# EAGLE design frienship_1 (EAGLE 6.1)
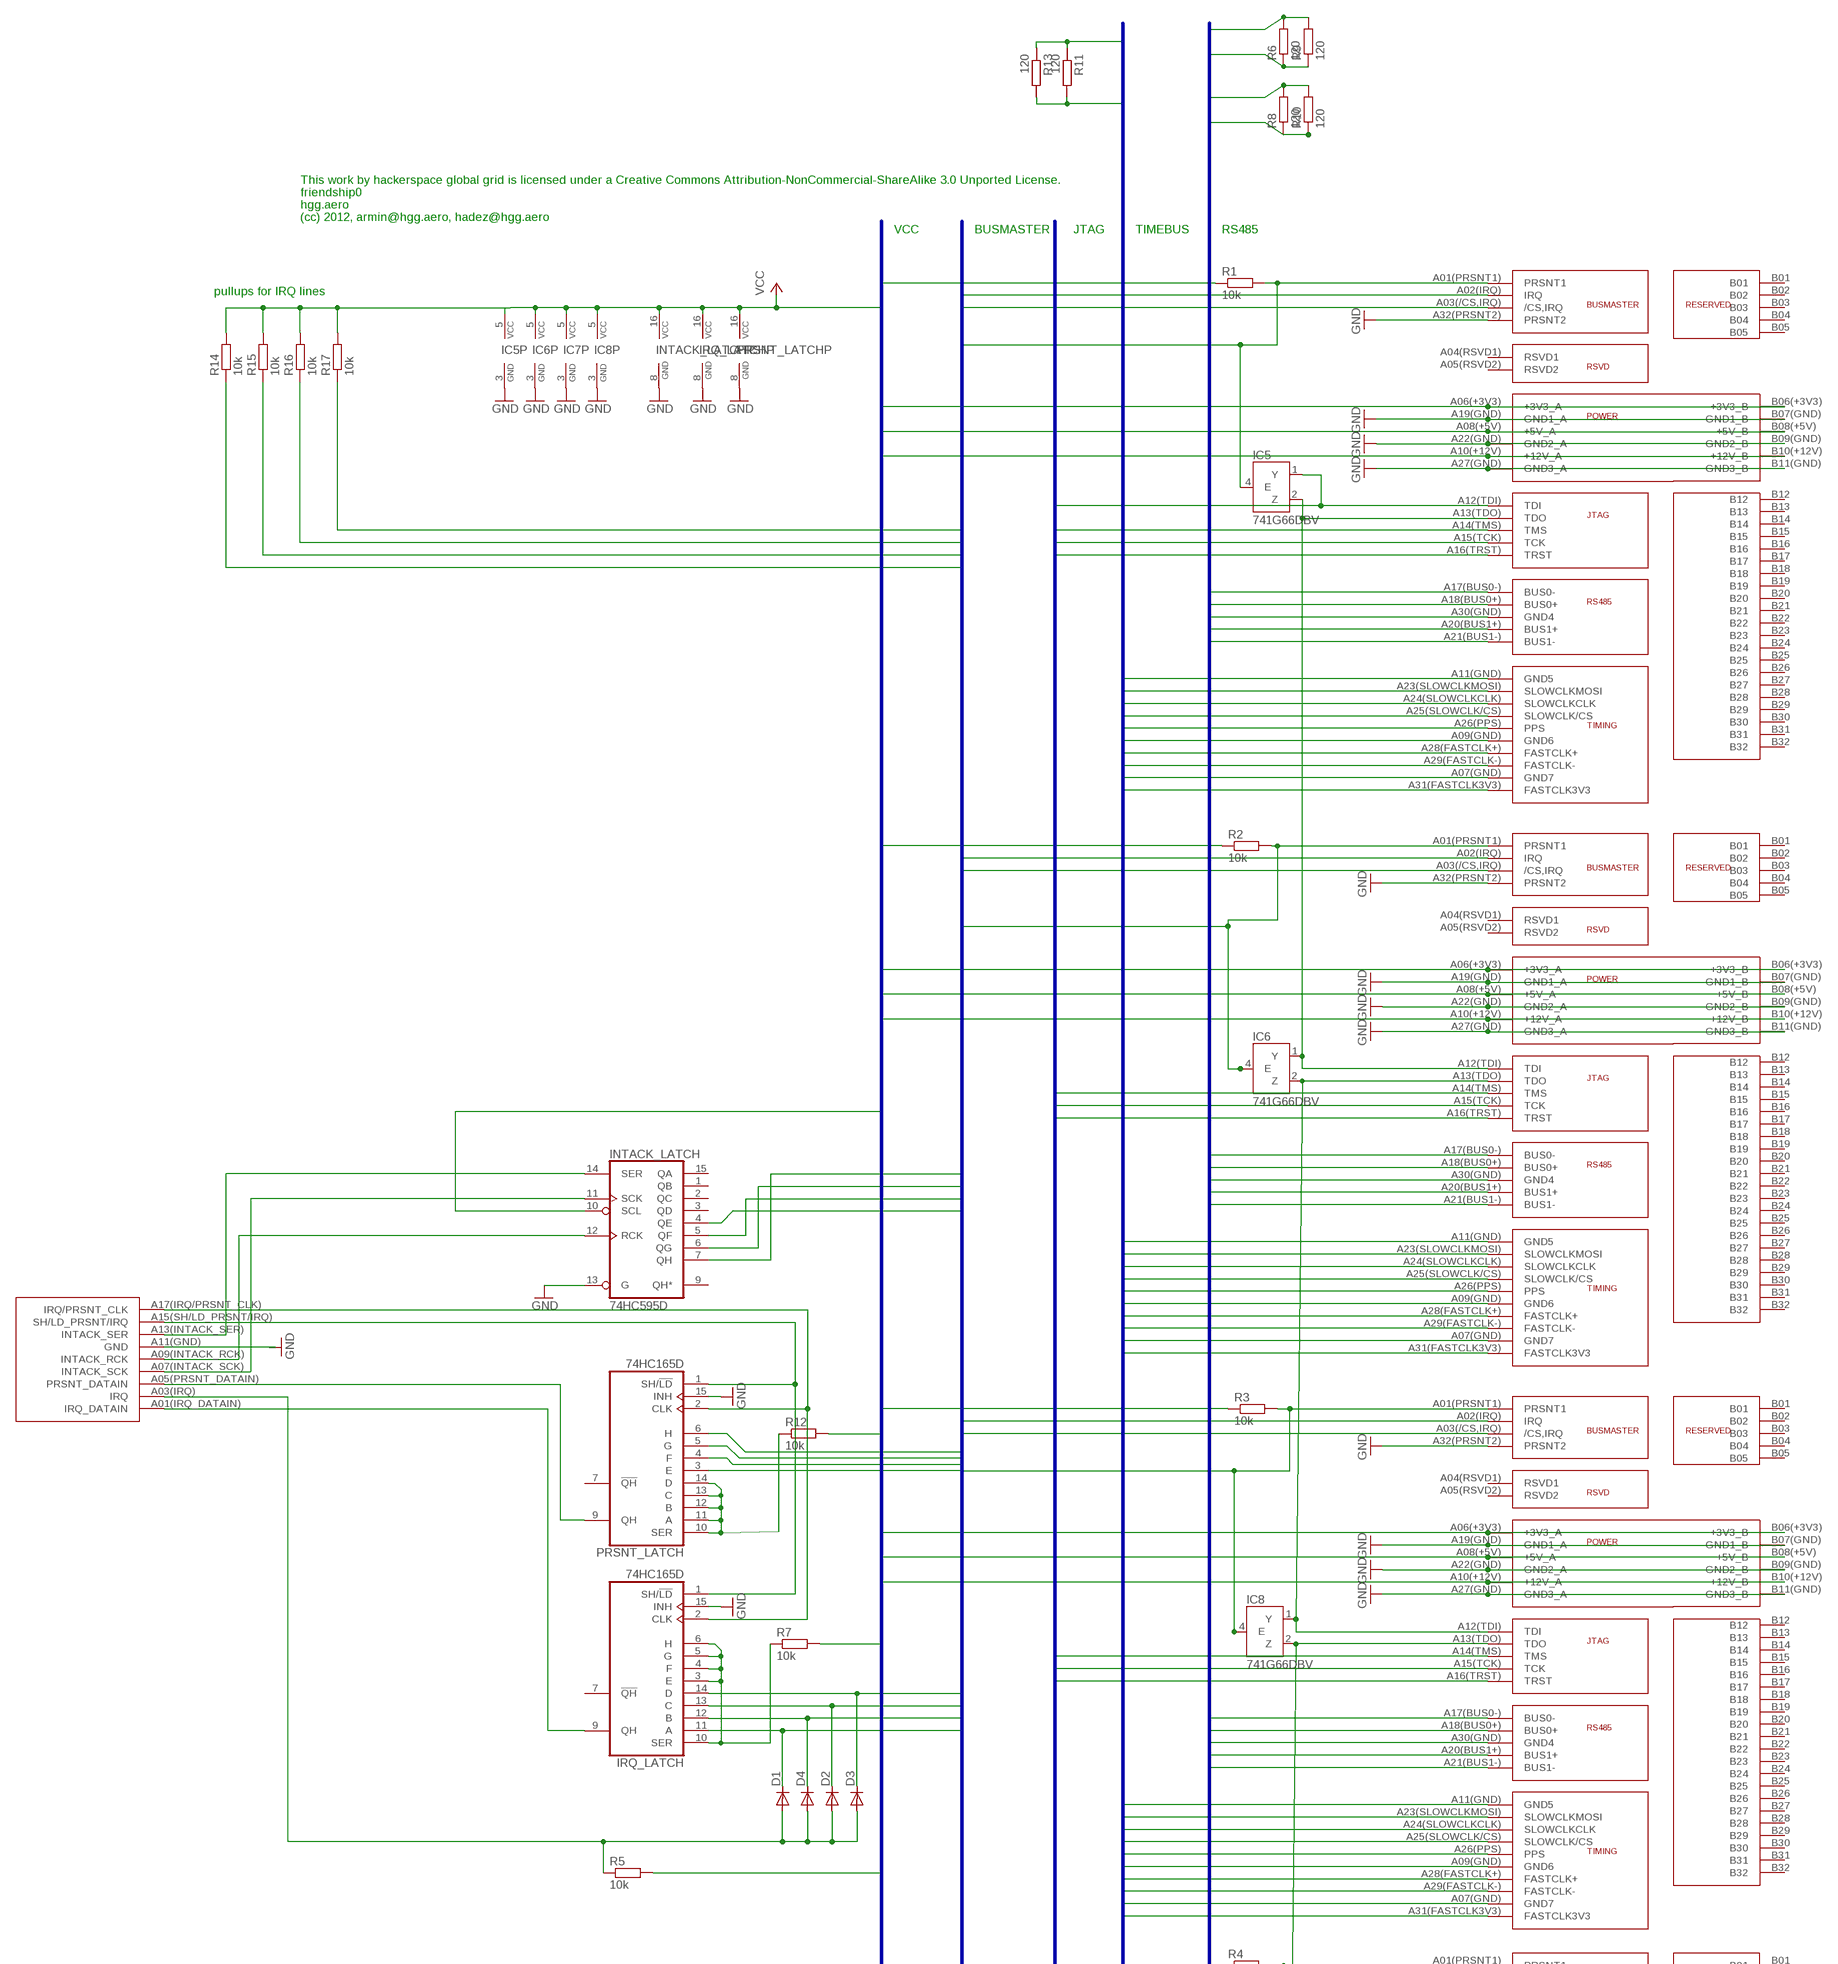
[diagram p0: schematic, sheet 1, part 1 of 2]
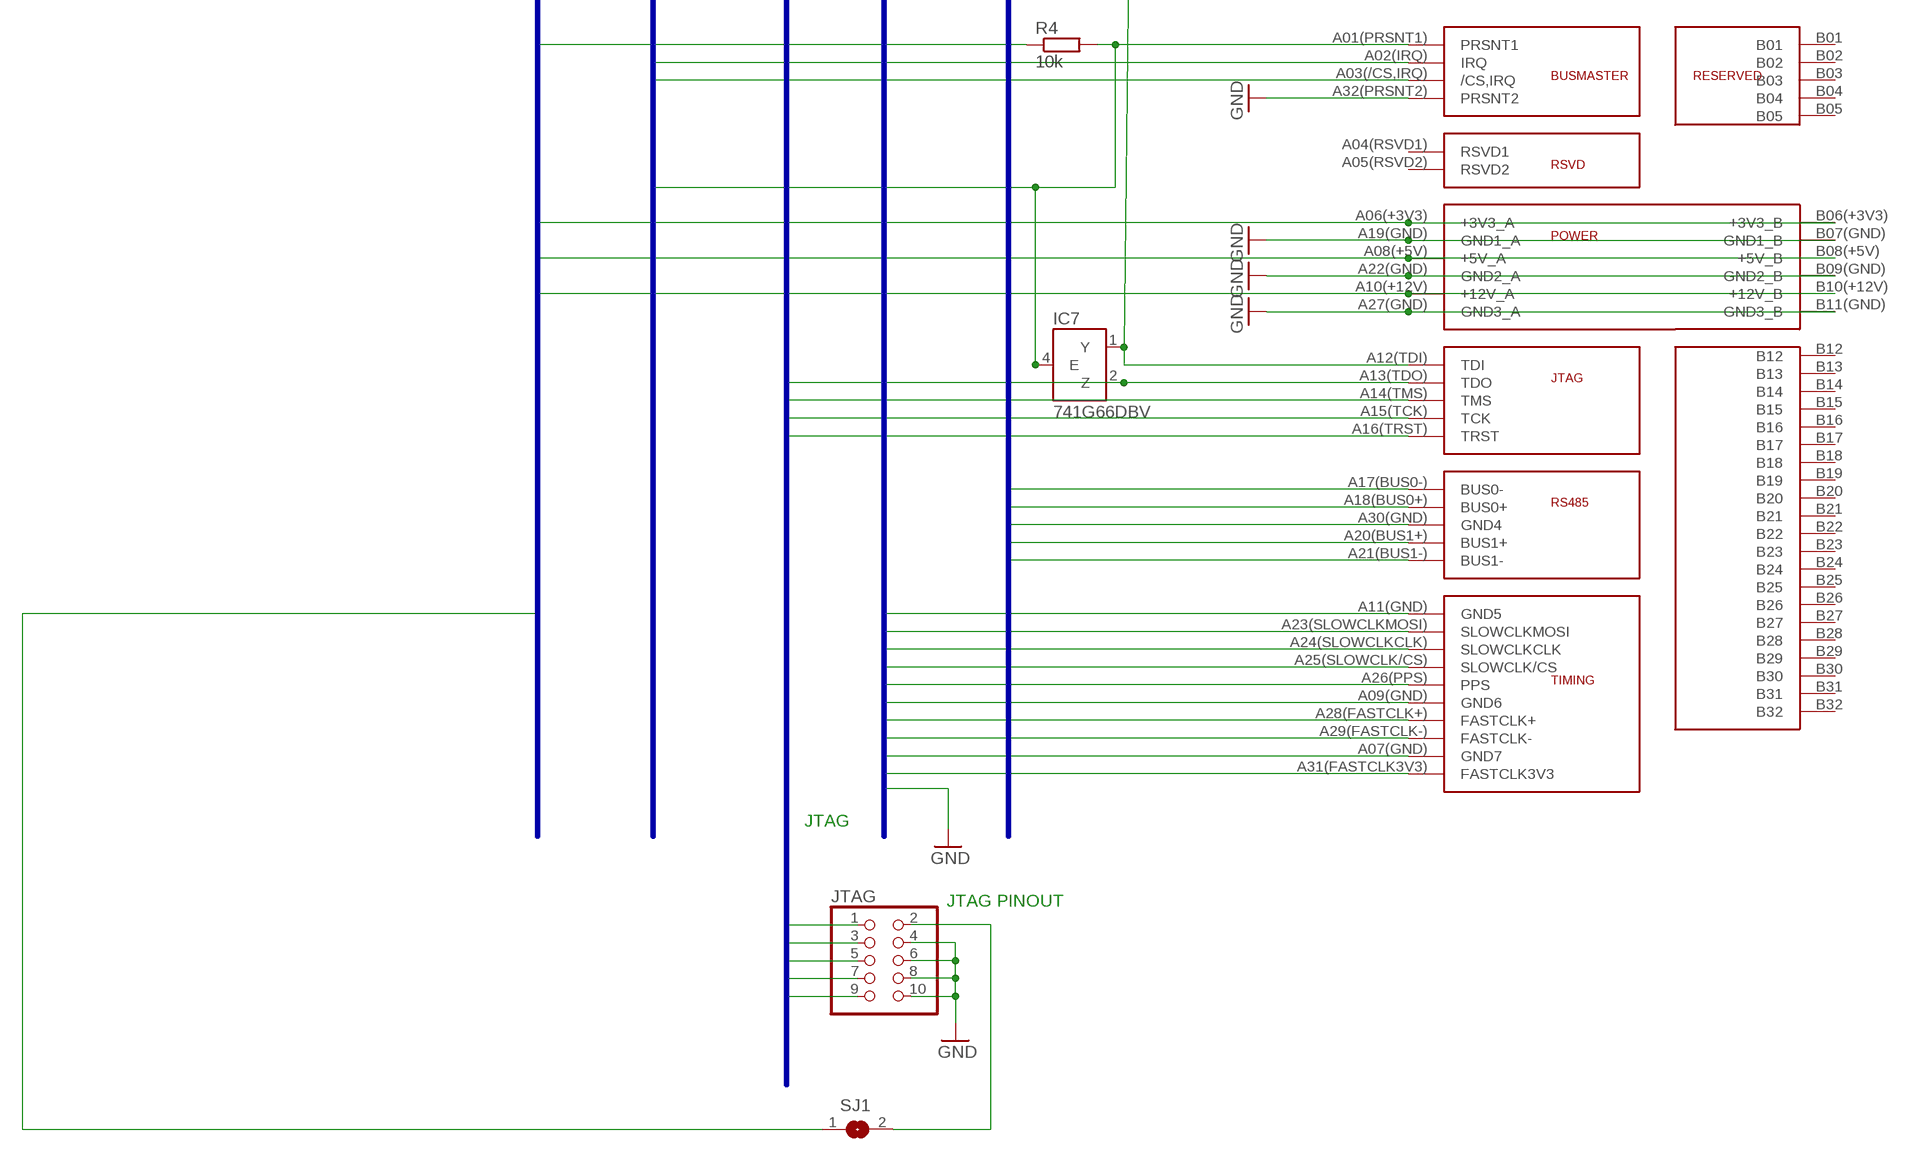
[diagram p1: schematic, sheet 1, part 2 of 2]

## Parts
D1  DIODE-SOD80C  [SOD80C]
D2  DIODE-SOD80C  [SOD80C]
D3  DIODE-SOD80C  [SOD80C]
D4  DIODE-SOD80C  [SOD80C]
IC5  741G66DBV  [SOT23-5]
IC6  741G66DBV  [SOT23-5]
IC7  741G66DBV  [SOT23-5]
IC8  741G66DBV  [SOT23-5]
INTACK_LATCH  74HC595D  [SO16]
IRQ_LATCH  74HC165D  [SO16]
JTAG  PINHD-2X5  [2X05]
PORT0  FRIENDSHIPSLOT  [FRIENDSHIP_SLOT]
PORT1  FRIENDSHIPSLOT  [FRIENDSHIP_SLOT]
PORT2  FRIENDSHIPSLOT  [FRIENDSHIP_SLOT]
PORT3  FRIENDSHIPSLOT  [FRIENDSHIP_SLOT]
PRSNT_LATCH  74HC165D  [SO16]
R1  10k  R-EU_R0603  [R0603]
R2  10k  R-EU_R0603  [R0603]
R3  10k  R-EU_R0603  [R0603]
R4  10k  R-EU_R0603  [R0603]
R5  10k  R-EU_R0603  [R0603]
R6  120  R-EU_R0603  [R0603]
R7  10k  R-EU_R0603  [R0603]
R8  120  R-EU_R0603  [R0603]
R9  120  R-EU_R0603  [R0603]
R10  120  R-EU_R0603  [R0603]
R11  120  R-EU_R0603  [R0603]
R12  10k  R-EU_R0603  [R0603]
R13  120  R-EU_R0603  [R0603]
R14  10k  R-EU_R0603  [R0603]
R15  10k  R-EU_R0603  [R0603]
R16  10k  R-EU_R0603  [R0603]
R17  10k  R-EU_R0603  [R0603]
SJ1  SJ  [SJ]
U$1  BUSMASTER_PLUG  [BUSMASTER_SLOT]

## Nets
3V3: IC5.5(VCC) IC6.5(VCC) IC7.5(VCC) IC8.5(VCC) INTACK_LATCH.10(SCL) INTACK_LATCH.16(VCC) IRQ_LATCH.16(VCC) PORT0.A06(+3V3)(+3V3_A) PORT0.B06(+3V3)(+3V3_B) PORT1.A06(+3V3)(+3V3_A) PORT1.B06(+3V3)(+3V3_B) PORT2.A06(+3V3)(+3V3_A) PORT2.B06(+3V3)(+3V3_B) PORT3.A06(+3V3)(+3V3_A) PORT3.B06(+3V3)(+3V3_B) PRSNT_LATCH.16(VCC) R1.1 R2.1 R3.1 R4.1 R5.2 R7.2 R12.2 R14.2 R15.2 R16.2 R17.2 SJ1.1 ; supply symbol labelled VCC
5V: PORT0.A08(+5V)(+5V_A) PORT0.B08(+5V)(+5V_B) PORT1.A08(+5V)(+5V_A) PORT1.B08(+5V)(+5V_B) PORT2.A08(+5V)(+5V_A) PORT2.B08(+5V)(+5V_B) PORT3.A08(+5V)(+5V_A) PORT3.B08(+5V)(+5V_B)
12V: PORT0.A10(+12V)(+12V_A) PORT0.B10(+12V)(+12V_B) PORT1.A10(+12V)(+12V_A) PORT1.B10(+12V)(+12V_B) PORT2.A10(+12V)(+12V_A) PORT2.B10(+12V)(+12V_B) PORT3.A10(+12V)(+12V_A) PORT3.B10(+12V)(+12V_B)
/CS: PORT0.A25(SLOWCLK/CS)(SLOWCLK/CS) PORT1.A25(SLOWCLK/CS)(SLOWCLK/CS) PORT2.A25(SLOWCLK/CS)(SLOWCLK/CS) PORT3.A25(SLOWCLK/CS)(SLOWCLK/CS)
/CS0: INTACK_LATCH.7(QH) PORT0.A03(/CS,IRQ)(/CS,IRQ)
/CS1: INTACK_LATCH.6(QG) PORT1.A03(/CS,IRQ)(/CS,IRQ)
/CS2: INTACK_LATCH.5(QF) PORT2.A03(/CS,IRQ)(/CS,IRQ)
/CS3: INTACK_LATCH.4(QE) PORT3.A03(/CS,IRQ)(/CS,IRQ)
CLK: PORT0.A24(SLOWCLKCLK)(SLOWCLKCLK) PORT1.A24(SLOWCLKCLK)(SLOWCLKCLK) PORT2.A24(SLOWCLKCLK)(SLOWCLKCLK) PORT3.A24(SLOWCLKCLK)(SLOWCLKCLK)
FASTCLK3V3: PORT0.A31(FASTCLK3V3)(FASTCLK3V3) PORT1.A31(FASTCLK3V3)(FASTCLK3V3) PORT2.A31(FASTCLK3V3)(FASTCLK3V3) PORT3.A31(FASTCLK3V3)(FASTCLK3V3)
FASTCLK+: PORT0.A28(FASTCLK+)(FASTCLK+) PORT1.A28(FASTCLK+)(FASTCLK+) PORT2.A28(FASTCLK+)(FASTCLK+) PORT3.A28(FASTCLK+)(FASTCLK+) R11.1 R13.1
FASTCLK-: PORT0.A29(FASTCLK-)(FASTCLK-) PORT1.A29(FASTCLK-)(FASTCLK-) PORT2.A29(FASTCLK-)(FASTCLK-) PORT3.A29(FASTCLK-)(FASTCLK-) R11.2 R13.2
GND: IC5.3(GND) IC6.3(GND) IC7.3(GND) IC8.3(GND) INTACK_LATCH.8(GND) INTACK_LATCH.13(G) IRQ_LATCH.8(GND) IRQ_LATCH.15(INH) JTAG.4 JTAG.6 JTAG.8 JTAG.10 PORT0.A07(GND)(GND7) PORT0.A09(GND)(GND6) PORT0.A11(GND)(GND5) PORT0.A19(GND)(GND1_A) PORT0.A22(GND)(GND2_A) PORT0.A27(GND)(GND3_A) PORT0.A30(GND)(GND4) PORT0.A32(PRSNT2)(PRSNT2) PORT0.B07(GND)(GND1_B) PORT0.B09(GND)(GND2_B) PORT0.B11(GND)(GND3_B) PORT1.A07(GND)(GND7) PORT1.A09(GND)(GND6) PORT1.A11(GND)(GND5) PORT1.A19(GND)(GND1_A) PORT1.A22(GND)(GND2_A) PORT1.A27(GND)(GND3_A) PORT1.A30(GND)(GND4) PORT1.A32(PRSNT2)(PRSNT2) PORT1.B07(GND)(GND1_B) PORT1.B09(GND)(GND2_B) PORT1.B11(GND)(GND3_B) PORT2.A07(GND)(GND7) PORT2.A09(GND)(GND6) PORT2.A11(GND)(GND5) PORT2.A19(GND)(GND1_A) PORT2.A22(GND)(GND2_A) PORT2.A27(GND)(GND3_A) PORT2.A30(GND)(GND4) PORT2.A32(PRSNT2)(PRSNT2) PORT2.B07(GND)(GND1_B) PORT2.B09(GND)(GND2_B) PORT2.B11(GND)(GND3_B) PORT3.A07(GND)(GND7) PORT3.A09(GND)(GND6) PORT3.A11(GND)(GND5) PORT3.A19(GND)(GND1_A) PORT3.A22(GND)(GND2_A) PORT3.A27(GND)(GND3_A) PORT3.A30(GND)(GND4) PORT3.A32(PRSNT2)(PRSNT2) PORT3.B07(GND)(GND1_B) PORT3.B09(GND)(GND2_B) PORT3.B11(GND)(GND3_B) PRSNT_LATCH.8(GND) PRSNT_LATCH.15(INH)
IRQ0: D3.C IRQ_LATCH.14(D) PORT0.A02(IRQ)(IRQ) R17.1
IRQ1: D2.C IRQ_LATCH.13(C) PORT1.A02(IRQ)(IRQ) R16.1
IRQ2: D4.C IRQ_LATCH.12(B) PORT2.A02(IRQ)(IRQ) R15.1
IRQ3: D1.C IRQ_LATCH.11(A) PORT3.A02(IRQ)(IRQ) R14.1
MOSI: PORT0.A23(SLOWCLKMOSI)(SLOWCLKMOSI) PORT1.A23(SLOWCLKMOSI)(SLOWCLKMOSI) PORT2.A23(SLOWCLKMOSI)(SLOWCLKMOSI) PORT3.A23(SLOWCLKMOSI)(SLOWCLKMOSI)
N$1: INTACK_LATCH.14(SER) U$1.A13(INTACK_SER)(INTACK_SER)
N$2: IC5.2(Z) IC6.1(Y) PORT0.A13(TDO)(TDO) PORT1.A12(TDI)(TDI)
N$3: IRQ_LATCH.1(SH/!LD) PRSNT_LATCH.1(SH/!LD) U$1.A15(SH/LD_PRSNT/IRQ)(SH/LD_PRSNT/IRQ)
N$4: INTACK_LATCH.11(SCK) U$1.A07(INTACK_SCK)(INTACK_SCK)
N$5: JTAG.2 SJ1.2
N$6: IC6.2(Z) IC8.1(Y) PORT1.A13(TDO)(TDO) PORT2.A12(TDI)(TDI)
N$7: IC7.1(Y) IC8.2(Z) PORT2.A13(TDO)(TDO) PORT3.A12(TDI)(TDI)
N$8: IRQ_LATCH.3(E) IRQ_LATCH.4(F) IRQ_LATCH.5(G) IRQ_LATCH.6(H) IRQ_LATCH.10(SER) R7.1
N$9: INTACK_LATCH.12(RCK) U$1.A09(INTACK_RCK)(INTACK_RCK)
N$10: PRSNT_LATCH.10(SER) PRSNT_LATCH.11(A) PRSNT_LATCH.12(B) PRSNT_LATCH.13(C) PRSNT_LATCH.14(D) R12.1
N$11: D1.A D2.A D3.A D4.A R5.1 U$1.A03(IRQ)(IRQ)
N$12: U$1.A11(GND)(GND)
N$13: PRSNT_LATCH.9(QH) U$1.A05(PRSNT_DATAIN)(PRSNT_DATAIN)
N$17: IRQ_LATCH.9(QH) U$1.A01(IRQ_DATAIN)(IRQ_DATAIN)
PPS: PORT0.A26(PPS)(PPS) PORT1.A26(PPS)(PPS) PORT2.A26(PPS)(PPS) PORT3.A26(PPS)(PPS)
PRSNT0: IC5.4(E) PORT0.A01(PRSNT1)(PRSNT1) PRSNT_LATCH.6(H) R1.2
PRSNT1: IC6.4(E) PORT1.A01(PRSNT1)(PRSNT1) PRSNT_LATCH.5(G) R2.2
PRSNT2: IC8.4(E) PORT2.A01(PRSNT1)(PRSNT1) PRSNT_LATCH.4(F) R3.2
PRSNT3: IC7.4(E) PORT3.A01(PRSNT1)(PRSNT1) PRSNT_LATCH.3(E) R4.2
RX+: PORT0.A20(BUS1+)(BUS1+) PORT1.A20(BUS1+)(BUS1+) PORT2.A20(BUS1+)(BUS1+) PORT3.A20(BUS1+)(BUS1+) R8.2 R10.2
RX-: PORT0.A21(BUS1-)(BUS1-) PORT1.A21(BUS1-)(BUS1-) PORT2.A21(BUS1-)(BUS1-) PORT3.A21(BUS1-)(BUS1-) R8.1 R10.1
SHIFT: IRQ_LATCH.2(CLK) PRSNT_LATCH.2(CLK) U$1.A17(IRQ/PRSNT_CLK)(IRQ/PRSNT_CLK)
TCK: JTAG.7 PORT0.A15(TCK)(TCK) PORT1.A15(TCK)(TCK) PORT2.A15(TCK)(TCK) PORT3.A15(TCK)(TCK)
TDI: IC5.1(Y) JTAG.1 PORT0.A12(TDI)(TDI)
TDO: IC7.2(Z) JTAG.3 PORT3.A13(TDO)(TDO)
TMS: JTAG.5 PORT0.A14(TMS)(TMS) PORT1.A14(TMS)(TMS) PORT2.A14(TMS)(TMS) PORT3.A14(TMS)(TMS)
TRST: JTAG.9 PORT0.A16(TRST)(TRST) PORT1.A16(TRST)(TRST) PORT2.A16(TRST)(TRST) PORT3.A16(TRST)(TRST)
TX+: PORT0.A18(BUS0+)(BUS0+) PORT1.A18(BUS0+)(BUS0+) PORT2.A18(BUS0+)(BUS0+) PORT3.A18(BUS0+)(BUS0+) R6.2 R9.2
TX-: PORT0.A17(BUS0-)(BUS0-) PORT1.A17(BUS0-)(BUS0-) PORT2.A17(BUS0-)(BUS0-) PORT3.A17(BUS0-)(BUS0-) R6.1 R9.1
Unconnected: INTACK_LATCH.1(QB) INTACK_LATCH.2(QC) INTACK_LATCH.3(QD) INTACK_LATCH.9(QH*) INTACK_LATCH.15(QA) IRQ_LATCH.7(!QH) PORT0.A04(RSVD1)(RSVD1) PORT0.A05(RSVD2)(RSVD2) PORT0.B01 PORT0.B02 PORT0.B03 PORT0.B04 PORT0.B05 PORT0.B12 PORT0.B13 PORT0.B14 PORT0.B15 PORT0.B16 PORT0.B17 PORT0.B18 PORT0.B19 PORT0.B20 PORT0.B21 PORT0.B22 PORT0.B23 PORT0.B24 PORT0.B25 PORT0.B26 PORT0.B27 PORT0.B28 PORT0.B29 PORT0.B30 PORT0.B31 PORT0.B32 PORT1.A04(RSVD1)(RSVD1) PORT1.A05(RSVD2)(RSVD2) PORT1.B01 PORT1.B02 PORT1.B03 PORT1.B04 PORT1.B05 PORT1.B12 PORT1.B13 PORT1.B14 PORT1.B15 PORT1.B16 PORT1.B17 PORT1.B18 PORT1.B19 PORT1.B20 PORT1.B21 PORT1.B22 PORT1.B23 PORT1.B24 PORT1.B25 PORT1.B26 PORT1.B27 PORT1.B28 PORT1.B29 PORT1.B30 PORT1.B31 PORT1.B32 PORT2.A04(RSVD1)(RSVD1) PORT2.A05(RSVD2)(RSVD2) PORT2.B01 PORT2.B02 PORT2.B03 PORT2.B04 PORT2.B05 PORT2.B12 PORT2.B13 PORT2.B14 PORT2.B15 PORT2.B16 PORT2.B17 PORT2.B18 PORT2.B19 PORT2.B20 PORT2.B21 PORT2.B22 PORT2.B23 PORT2.B24 PORT2.B25 PORT2.B26 PORT2.B27 PORT2.B28 PORT2.B29 PORT2.B30 PORT2.B31 PORT2.B32 PORT3.A04(RSVD1)(RSVD1) PORT3.A05(RSVD2)(RSVD2) PORT3.B01 PORT3.B02 PORT3.B03 PORT3.B04 PORT3.B05 PORT3.B12 PORT3.B13 PORT3.B14 PORT3.B15 PORT3.B16 PORT3.B17 PORT3.B18 PORT3.B19 PORT3.B20 PORT3.B21 PORT3.B22 PORT3.B23 PORT3.B24 PORT3.B25 PORT3.B26 PORT3.B27 PORT3.B28 PORT3.B29 PORT3.B30 PORT3.B31 PORT3.B32 PRSNT_LATCH.7(!QH)

## Buses
IRQ0,IRQ1,IRQ2,IRQ3,/CS0,/CS1,/CS2,/CS3,PRSNT0,PRSNT1,PRSNT2,PRSNT3
TDI,TDO,TMS,TCK,TRST
GND,MOSI,CLK,/CS,PPS,FASTCLK+,FASTCLK-,FASTCLK3V3
TX+,TX-,GND,RX+,RX-
3V3,5V,12V

## Notes on the sheet
- This work by hackerspace global grid is licensed under a Creative Commons Attribution-NonCommercial-ShareAlike 3.0 Unported License.
- friendship0
- hgg.aero
- (cc) 2012, armin@hgg.aero, hadez@hgg.aero
- VCC | BUSMASTER | JTAG | TIMEBUS | RS485
- pullups for IRQ lines
- JTAG
- JTAG PINOUT

## Library data of the parts
D1-D4 = diode:DIODE-: DIODE
IC5-IC8 = 74xx-little-de:74*1G66: Single Analog / Bilateral Switch Source: http://www.semiconductors.philips.com/acrobat_download/datasheets/74HC_HCT1G66_3.pdf
INTACK_LATCH = 74xx-eu:74*595: 8-bit SHIFT REGISTER, output latch
IRQ_LATCH PRSNT_LATCH = 74xx-eu:74*165: 8-bit parallel load SHIFT REGISTER
JTAG = pinhead:PINHD-2X5: PIN HEADER
PORT0 PORT1-PORT3 = hgg:FRIENDSHIP
R1-R17 = rcl:R-EU_: RESISTOR, European symbol
SJ1 = jumper:SJ: SMD solder JUMPER
U$1 = hgg:BUSMASTER_PLUG

## Board
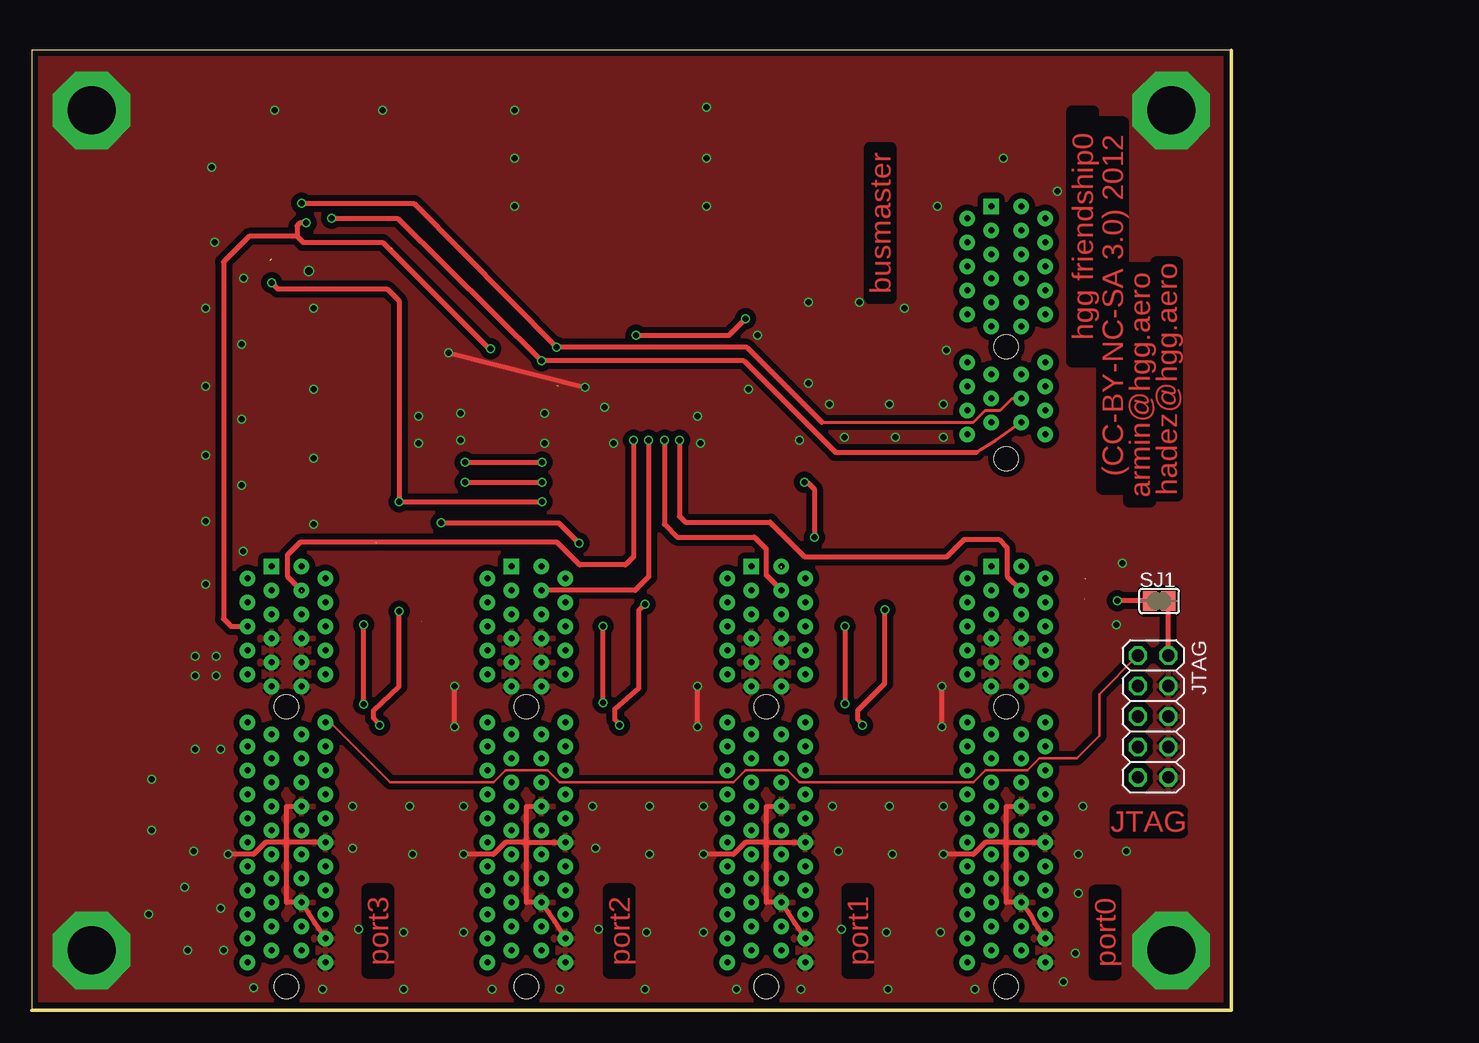
[diagram p2: board, top side]
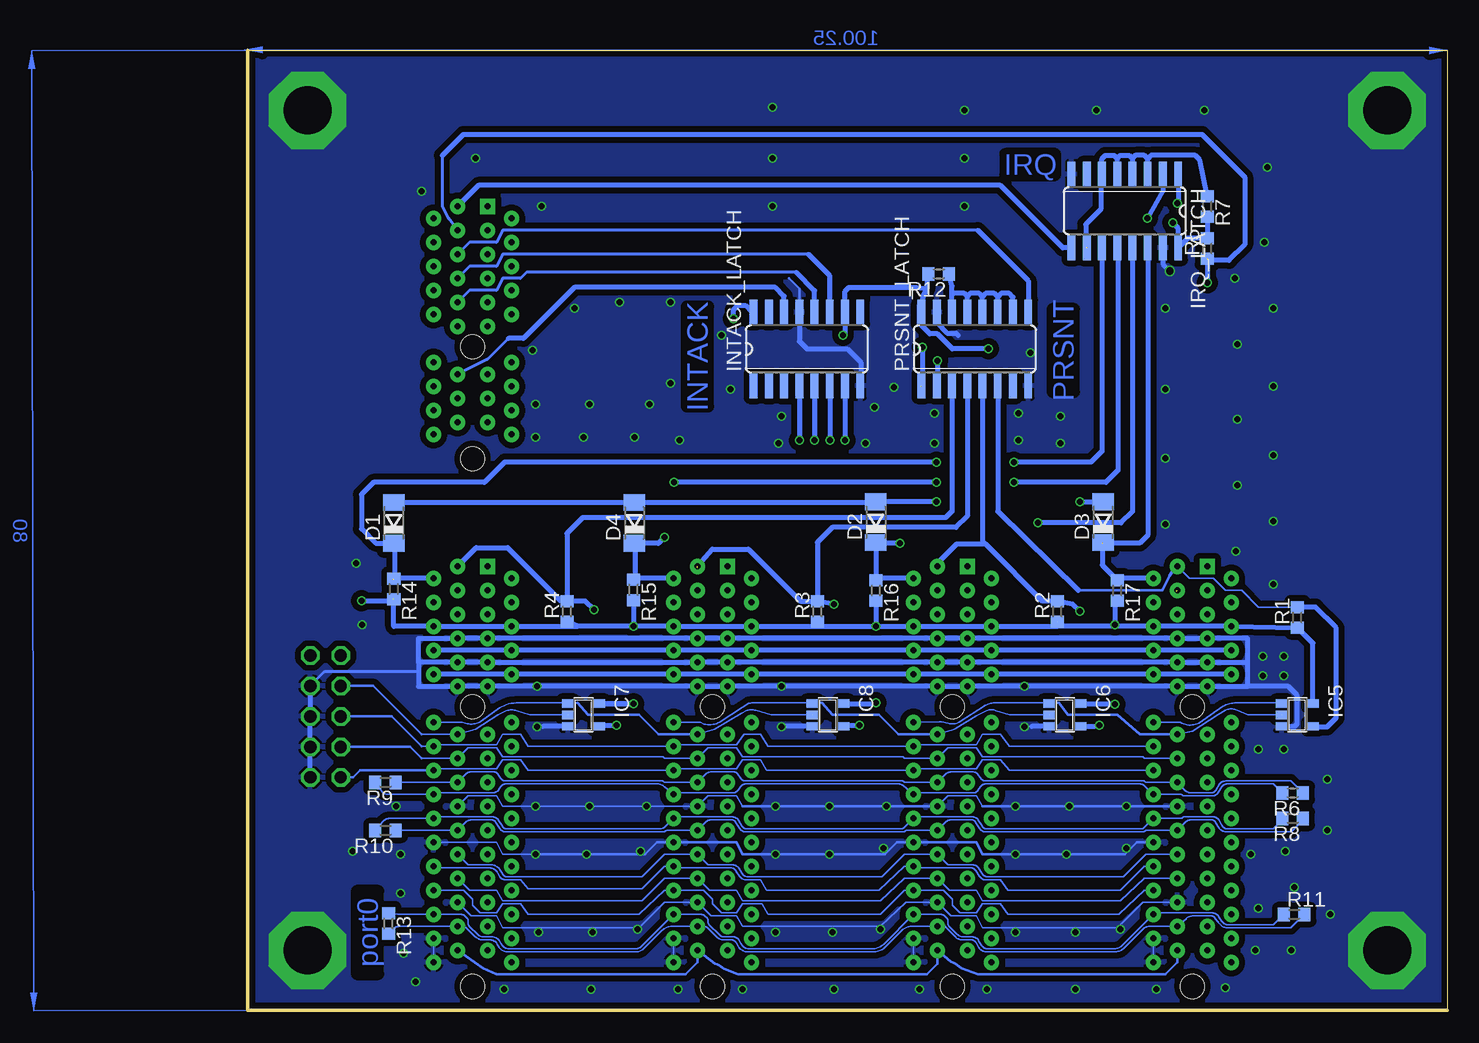
[diagram p3: board, bottom side, seen from below]

Size 100 x 80 mm. Coordinates in mm from the lower left corner, seen from the top.
Outline: 0,0 100,0 100,80 0,80 0,0
Copper layers (1*16): Top 0.035mm / dielectric 1.5mm / Bottom 0.035mm
Design rules: minimum track width 0.125mm, minimum drill 0.2mm, track to track 0.125mm, track to pad 0.125mm, pad to pad 0.125mm, via to via 0.125mm, smd to smd 0.125mm, copper to edge 0.3mm, drill to drill 0.2mm, minimum pad ring 0.2mm, minimum via ring 0.125mm, stop-mask expansion 0.075mm, vias tented up to drill 0mil, thermal gap 0.2mm

### Footprints (pad centres in the part's own frame; a part is rotated, then mirrored left to right if it is on the bottom)
SOD80C = smd 1.4 x 1.8: A 1.7,0; C -1.7,0
SOT23-5 = smd 0.69 x 0.99: 1 -0.95,-1.29; 2 0,-1.29; 3 0.95,-1.29; 4 0.95,1.3; 5 -0.95,1.3
SO16 = smd 0.66 x 2.032: 1 -4.445,-3.073; 2 -3.175,-3.073; 3 -1.905,-3.073; 4 -0.635,-3.073; 5 0.635,-3.073; 6 1.905,-3.073; 7 3.175,-3.073; 8 4.445,-3.073; 9 4.445,3.073; 10 3.175,3.073; 11 1.905,3.073; 12 0.635,3.073; 13 -0.635,3.073; 14 -1.905,3.073; 15 -3.175,3.073; 16 -4.445,3.073
2X05 = drill 1.016 octagon: 1 -5.08,-1.27; 2 -5.08,1.27; 3 -2.54,-1.27; 4 -2.54,1.27; 5 0,-1.27; 6 0,1.27; 7 2.54,-1.27; 8 2.54,1.27; 9 5.08,-1.27; 10 5.08,1.27
FRIENDSHIP_SLOT = drill 0.5 pad 1.27: A01(PRSNT1) 0,2.5; A02(IRQ) 1,4.5; A03(/CS,IRQ) 2,2.5; A04(RSVD1) 3,4.5; A05(RSVD2) 4,2.5; A06(+3V3) 5,4.5; A07(GND) 6,2.5; A08(+5V) 7,4.5; A09(GND) 8,2.5; A10(+12V) 9,4.5; A11(GND) 10,2.5; A12(TDI) 13,4.5; A13(TDO) 14,2.5; A14(TMS) 15,4.5; A15(TCK) 16,2.5; A16(TRST) 17,4.5; A17(BUS0-) 18,2.5; A18(BUS0+) 19,4.5; A19(GND) 20,2.5; A20(BUS1+) 21,4.5; A21(BUS1-) 22,2.5; A22(GND) 23,4.5; A23(SLOWCLKMOSI) 24,2.5; A24(SLOWCLKCLK) 25,4.5; A25(SLOWCLK/CS) 26,2.5; A26(PPS) 27,4.5; A27(GND) 28,2.5; A28(FASTCLK+) 29,4.5; A29(FASTCLK-) 30,2.5; A30(GND) 31,4.5; A31(FASTCLK3V3) 32,2.5; A32(PRSNT2) 33,4.5; B02 1,-2; B03 2,0; B04 3,-2; B05 4,0; B06(+3V3) 5,-2; B07(GND) 6,0; B08(+5V) 7,-2; B09(GND) 8,0; B10(+12V) 9,-2; B11(GND) 10,0; B12 13,-2; B13 14,0; B14 15,-2; B15 16,0; B16 17,-2; B17 18,0; B18 19,-2; B19 20,0; B20 21,-2; B21 22,0; B22 23,-2; B23 24,0; B24 25,-2; B25 26,0; B26 27,-2; B27 28,0; B28 29,-2; B29 30,0; B30 31,-2; B31 32,0; B32 33,-2 | drill 0.5 pad 1.27 square: B01 0,0 | hole 2: 11.7,1.25; 35,1.25
R0603 = smd 1 x 1.1: 1 -0.85,0; 2 0.85,0
SJ = smd 1.168 x 1.6: 1 -0.762,0; 2 0.762,0
BUSMASTER_SLOT = drill 0.5 pad 1.27: A01(IRQ_DATAIN) 0,2.5; A02 1,4.5; A03(IRQ) 2,2.5; A04 3,4.5; A05(PRSNT_DATAIN) 4,2.5; A06 5,4.5; A07(INTACK_SCK) 6,2.5; A08 7,4.5; A09(INTACK_RCK) 8,2.5; A10 9,4.5; A11(GND) 10,2.5; A12 13,4.5; A13(INTACK_SER) 14,2.5; A14 15,4.5; A15(SH/LD_PRSNT/IRQ) 16,2.5; A16 17,4.5; A17(IRQ/PRSNT_CLK) 18,2.5; A18 19,4.5; B02 1,-2; B03 2,0; B04 3,-2; B05 4,0; B06 5,-2; B07 6,0; B08 7,-2; B09 8,0; B10 9,-2; B11 10,0; B12 13,-2; B13 14,0; B14 15,-2; B15 16,0; B16 17,-2; B17 18,0; B18 19,-2 | drill 0.5 pad 1.27 square: B01 0,0 | hole 2: 11.7,1.25; 21.03,1.25

### Placement (x,y rotation side)
D1  87.81,40.62 90 bottom
D2  47.62,40.69 90 bottom
D3  28.69,40.69 90 bottom
D4  67.75,40.62 90 bottom
IC5  12.5,24.62 270 bottom
IC6  31.88,24.62 270 bottom
IC7  72,24.62 270 bottom
IC8  51.62,24.62 270 bottom
INTACK_LATCH  53.38,55.12 0 bottom
IRQ_LATCH  26.88,66.62 180 bottom
JTAG  93.5,24.5 270 top
PORT0  20,37 270 top
PORT1  40,37 270 top
PORT2  60,37 270 top
PORT3  80,37 270 top
PRSNT_LATCH  39.38,55.12 0 bottom
R1  12.5,32.75 90 bottom
R2  32.5,33.25 90 bottom
R3  52.5,33.25 90 bottom
R4  73.38,33.25 90 bottom
R5  20,63.5 90 bottom
R6  12.88,18.12 180 bottom
R7  20,67 270 bottom
R8  12.88,16 180 bottom
R9  88.5,19 180 bottom
R10  88.5,15 180 bottom
R11  12.75,8 0 bottom
R12  42.38,61.38 180 bottom
R13  88.25,7.25 270 bottom
R14  87.81,35.12 270 bottom
R15  67.84,35.05 270 bottom
R16  47.62,35 270 bottom
R17  27.5,35 270 bottom
SJ1  94,34.12 0 top
U$1  80,67 270 top

### Tracks (layer width: path | path; a pad name or v marks a point on that pad's centre or on a via)
3V3  (via drill 0.5)  (2 unrouted)
  Top 0.406: v47.62,25.62 v47.62,32 | v22.88,65.62 22.38,65.62 22.12,65.38 22.12,64.5 | 22.12,64.5 22.62,64 29.25,64 38.12,55.12 v38.25,55.12 | v50.38,56.25 58.12,56.25 v59.5,57.62 | 22.12,64.5 18.12,64.5 16,62.38 16,32.62 16.62,32 PORT0.B06(+3V3) | v27.69,25.5 v27.69,32.12 | v67.81,32 v67.81,25.56 | SJ1.1 v90.5,34.12
  Bottom 0.125: R12.2 43.38,61.23
  Bottom 0.406: R7.2 R5.2 21.63,64.35 IRQ_LATCH.16 22.43,65.18 v22.88,65.62 | 52.5,32 v47.62,32 | v47.62,32 PORT1.A06(+3V3) PORT1.B06(+3V3) 32.5,32 R2.1 | 52.5,32 PORT2.B06(+3V3) PORT2.A06(+3V3) v67.81,32 | 52.5,32 R3.1 | 73.5,32 PORT3.B06(+3V3) PORT3.A06(+3V3) 87.81,32 R14.2 | 72.5,32 R4.1 | IC8.5 47.67,25.57 v47.62,25.62 | IC5.5 11.2,30.6 R1.1 PORT0.B06(+3V3) PORT0.A06(+3V3) 27.69,32 | PRSNT_LATCH.16 43.74,59.03 | 43.74,59.03 43.7,59.43 43.38,60.12 | 43.38,61.23 43.38,60.12 | v38.25,55.12 41.25,55.12 42.5,56.38 43.12,56.38 44,57.25 44,58.77 43.74,59.03 | 43.38,60.12 44.25,60.25 49.88,60.25 50.2,59.92 INTACK_LATCH.10 50.2,56.42 v50.38,56.25 | v59.5,57.62 59.5,58.38 59.12,58.75 58.5,58.75 57.95,58.2 | 57.95,58.2 57.88,58.12 57.75,58.12 | INTACK_LATCH.16 57.95,58.2 | R16.2 v47.62,32 | 27.69,32 32.56,32 32.56,32.38 32.5,32.38 32.5,32.44 | R17.2 27.69,34.34 v27.69,32.12 27.69,32 | IC6.5 27.69,25.57 v27.69,25.5 | v67.81,32 72.5,32 | 73.5,32.25 73.5,32.44 73.31,32.44 73.31,32.38 73.38,32.38 73.38,32.25 73.5,32.25 | 73.5,32.25 73.5,32 | 73.5,32 72.5,32 | R15.2 67.81,34.2 v67.81,32 | v90.5,34.12 87.81,34.12 87.81,34.31 | IC7.5 67.81,25.57 v67.81,25.56 IC7.5
5V
  Bottom 0.406: PORT0.B08(+5V) PORT0.A08(+5V) PORT1.B08(+5V) PORT1.A08(+5V) PORT2.B08(+5V) PORT2.A08(+5V) PORT3.B08(+5V) PORT3.A08(+5V)
12V
  Bottom 0.406: PORT0.B10(+12V) PORT0.A10(+12V) PORT1.B10(+12V) PORT1.A10(+12V) PORT2.B10(+12V) PORT2.A10(+12V) PORT3.B10(+12V) PORT3.A10(+12V)
/CS
  Bottom 0.125: PORT3.A25(SLOWCLK/CS) 81.5,10 79.25,10 78.75,9.12 67.12,9.12 65.25,11 PORT2.A25(SLOWCLK/CS) 61.5,10 59.25,10 58.75,9.12 47.25,9.12 45.25,11 PORT1.A25(SLOWCLK/CS) 41.5,10 39.25,10 38.75,9.12 27.25,9.12 25.25,11 PORT0.A25(SLOWCLK/CS)
/CS0  (via drill 0.5 pad 0.5)  (1 unrouted)
  Top 0.406: v50.19,47.5 50.19,37.81 49.5,37.12 45.69,37.12 43.81,39 22.38,39 21.31,37.94 21.31,36.19 22.56,34.94
  Bottom 0.406: INTACK_LATCH.7 50.2,47.51 v50.19,47.5
/CS1  (via drill 0.5 pad 0.5)
  Top 0.406: v51.44,47.5 51.44,36.12 50.31,35 PORT1.A03(/CS,IRQ)
  Bottom 0.406: INTACK_LATCH.6 51.47,47.53 v51.44,47.5
/CS2  (via drill 0.5)
  Top 0.406: v52.75,47.5 52.75,40.5 53.81,39.44 60.25,39.44 61.25,38.44 61.25,36.25 PORT2.A03(/CS,IRQ)
  Bottom 0.406: INTACK_LATCH.5 v52.74,47.51 v52.75,47.5
/CS3  (via drill 0.5 pad 0.5)
  Top 0.406: v54.01,47.51 54.01,41.18 54.5,40.69 61.56,40.69 64.44,37.81 76.31,37.81 77.75,39.25 80.62,39.25 81.31,38.56 81.31,36.19 PORT3.A03(/CS,IRQ)
  Bottom 0.406: INTACK_LATCH.4 v54.01,47.51
CLK
  Bottom 0.125: PORT3.A24(SLOWCLKCLK) 84.38,11.88 79.76,11.88 arc58 79.17,11.49 78.94,11.11 arc-58 78.4,10.88 77.25,10.88 76.62,10.12 67.12,10.12 65.25,12 PORT2.A24(SLOWCLKCLK) 64.38,11.88 59.69,11.88 arc58 59.27,11.61 59.01,11.19 arc-58 58.38,10.88 57.25,10.88 56.75,10 47.38,10 45.25,12 PORT1.A24(SLOWCLKCLK) 44.38,11.88 39.65,11.88 arc58 39.29,11.64 39,11.18 arc-58 38.39,10.88 37.25,10.88 36.62,10 27.25,10 25.25,12 PORT0.A24(SLOWCLKCLK)
FASTCLK3V3
  Bottom 0.2: PORT3.A31(FASTCLK3V3) 80.38,3.5 79.25,3 63.5,3 62.5,4 PORT2.A31(FASTCLK3V3) 61.03,3.91 arc20 60.3,3.46 59.12,3 43.38,3 42.5,3.88 PORT1.A31(FASTCLK3V3) 41.37,4.06 arc22 40.48,3.52 39.12,3 23.5,3 22.5,4 PORT0.A31(FASTCLK3V3)
FASTCLK+
  Bottom 0.125: R13.1 87.5,8 PORT3.A28(FASTCLK+) 82.19,8 arc45 81.87,7.87 81.7,7.7 arc45 81.62,7.52 81.62,7.31 arc-45 81.49,6.99 80.84,6.34 arc-45 80.32,6.12 79.67,6.12 arc58 79.03,5.83 78.86,5.56 arc-58 78.18,5.12 67.74,5.12 arc-45 67.12,5.38 PORT2.A28(FASTCLK+) 62.19,8 arc45 61.87,7.87 61.71,7.71 arc45 61.62,7.51 61.62,7.4 arc-45 61.52,7.15 60.66,6.29 arc-45 60.27,6.12 59.56,6.12 arc58 59.09,5.92 58.86,5.56 arc-58 58.18,5.12 47.95,5.12 arc-45 46.97,5.53 PORT1.A28(FASTCLK+) 42.21,8 arc45 41.85,7.85 41.74,7.74 arc45 41.62,7.46 41.62,7.28 arc-45 41.52,7.01 40.85,6.35 arc-45 40.31,6.12 39.6,6.12 arc58 39.06,5.83 38.81,5.42 arc-58 38.28,5.12 27.82,5.12 arc-45 27.06,5.44 PORT0.A28(FASTCLK+) 24.12,8.12 19.53,8.12 arc58 19.07,7.83 18.81,7.49 arc-58 18.27,7.12 14.47,7.12 R11.1
FASTCLK-
  Bottom 0.125: R13.2 87.84,6.81 arc45 87.38,7 PORT3.A29(FASTCLK-) 82.13,7 arc45 81.69,6.82 81.01,6.14 arc-45 80.38,5.88 79.72,5.88 arc58 79.19,5.52 79.03,5.26 arc-58 78.22,4.88 67.67,4.88 arc-45 66.95,5.17 65.45,6.67 arc45 64.66,7 PORT2.A29(FASTCLK-) 61.96,7 arc45 61.6,6.85 60.86,6.11 arc-45 60.3,5.88 59.62,5.88 arc58 59.3,5.66 59.07,5.29 arc-58 58.26,4.88 47.87,4.88 arc-45 46.81,5.31 45.42,6.71 arc45 44.71,7 PORT1.A29(FASTCLK-) 41.88,7 41.01,6.13 arc-45 40.38,5.88 39.62,5.88 arc58 39.3,5.66 39.04,5.23 arc-58 38.33,4.88 27.74,4.88 arc-45 26.9,5.22 25.31,6.82 arc45 24.87,7 PORT0.A29(FASTCLK-) 21.75,7.66 arc41 21.17,7.88 19.65,7.88 arc58 19.35,7.7 19.07,7.35 arc-58 18.26,6.88 13.03,6.88 R11.2
GND  (via drill 0.5, 0.6, 4 pad 6.45)
  Top 0.406: v35.25,23.62 v35.25,27 | v55.5,23.62 v55.5,27 | v75.88,23.62 v75.88,27 | v34.75,54.81 v46.12,51.94 | PORT2.A30(GND) 63.62,7.25 PORT2.A27(GND) 61.25,9 61.25,14 | PORT1.A30(GND) 43.62,7.38 PORT1.A27(GND) 41.25,9 41.25,14 | PORT0.A30(GND) 23.62,7.25 PORT0.A27(GND) 21.25,9 21.25,14 | PORT3.A30(GND) 83.62,7.25 83.25,8 PORT3.A27(GND) 81.25,9 81.25,14 | 21.25,14 21.25,17 PORT0.A19(GND) | PORT0.A22(GND) 21.25,14 | 41.25,14 PORT1.A22(GND) | 41.25,14 41.25,17 PORT1.A19(GND) | 61.25,14 61.25,17 PORT2.A19(GND) | 61.25,14 PORT2.A22(GND) | 81.25,14 81.25,17 PORT3.A19(GND) | 81.25,14 PORT3.A22(GND) | 21.25,14 19.5,14 18.5,13 v16.38,13 | 41,14 39.5,14 38.5,13 v36,13 | 61.12,14 59.5,14 58.5,13 v56,13 | 81.12,14 79.5,14 78.5,13 v76,13 | v23.12,61.62 22.94,61.62
  Bottom 0.125: PORT3.A22(GND) 79.25,14 78.75,13 v76,13 | 58.75,17 59.25,17.88 61.62,17.88 PORT2.A19(GND) v66.75,17 v71.5,17 v76,17 78.75,17 79.25,17.88 81.62,17.88 PORT3.A19(GND) | 38.75,17 39.25,17.88 41.62,17.88 PORT1.A19(GND) | PORT3.A27(GND) 81.38,7.88 79.25,7.88 78.75,6.88 67.38,6.88 65.25,9 PORT2.A27(GND) 61.38,7.88 59.25,7.88 58.75,7 47.25,7 45.12,9 PORT1.A27(GND) 41.38,7.88 39.25,7.88 38.75,6.88 27.5,6.88 25.38,9 PORT0.A27(GND) | PORT3.A32(PRSNT2) PORT3.A30(GND) | PORT2.A32(PRSNT2) PORT2.A30(GND) | PORT1.A32(PRSNT2) PORT1.A30(GND) | PORT0.A32(PRSNT2) PORT0.A30(GND) | 34.62,23.68 v35.25,23.62 | 55.5,23.68 v55.5,23.62 | 75.38,23.68 v75.88,23.62 | INTACK_LATCH.13
  Bottom 0.2: v76,13 v71.75,13 66.88,13 65.88,14 PORT2.A22(GND) 59.25,14 58.75,13 v56,13 v51.5,13 46.88,13 45.88,14 PORT1.A22(GND) 39.25,14 38.75,13 v36,13 v31.75,13 26.88,13 25.88,14 PORT0.A22(GND) | PORT1.A19(GND) v46.75,17 v51.5,17 v56,17 58.75,17 | PORT0.A19(GND) v26.75,17 v31.5,17 v36,17 38.75,17 | 54.88,61 54,60.12 INTACK_LATCH.13
  Bottom 0.254: JTAG.4 93.56,28.25 85.75,28.25
  Bottom 0.406: 62.75,31 PORT2.A07(GND) PORT2.B07(GND) PORT1.A07(GND) PORT1.B07(GND) PORT0.A07(GND) PORT0.B07(GND) 16.62,31 16.62,29 | 62.75,31 62.75,31.12 | 62.75,31 PORT3.B07(GND) PORT3.A07(GND) 85.75,31 85.75,29 | 85.75,29 PORT3.A09(GND) PORT3.B09(GND) PORT2.A09(GND) PORT2.B09(GND) PORT1.A09(GND) PORT1.B09(GND) PORT0.A09(GND) PORT0.B09(GND) | 85.75,29 85.75,28.25 85.75,27 PORT3.A11(GND) PORT3.B11(GND) v75.88,27 PORT2.A11(GND) PORT2.B11(GND) v55.5,27 PORT1.A11(GND) PORT1.B11(GND) v35.25,27 PORT0.A11(GND) PORT0.B11(GND) 16.62,27 | 16.62,27 16.62,29 | PORT0.B09(GND) 20,28.88 | PORT0.B09(GND) 16.62,29 | JTAG.10 JTAG.8 JTAG.6 JTAG.4 | IC6.3 34.62,23.68 | IC8.3 55.5,23.68 | IC7.3 75.38,23.68 | IC5.3 12.7,23.68 12.5,23.88 12.5,26.25 13.25,27 16.62,27 | INTACK_LATCH.13 54,55.75 53.38,55.12 50,55.12 48.88,54 48.88,52 | PRSNT_LATCH.15 42.55,57.3 41.69,56.44 40.94,56.44 40.75,56.25 | IRQ_LATCH.15 23.7,62.2 v23.12,61.62
  other vias: 13.62,29.5 15.38,29.5 15.38,27.88 13.62,27.88 13.62,21.75 15.75,21.75 90.44,32.12 87.62,17 86,2.38 23.5,58.5 17.62,38.25 17.69,61 95,5 95,75 5,75 5,5 90.94,37.25 40.25,67 40.25,75 40.25,71 56.25,75.25 56.25,67 56.25,71 76,47.75 67.75,47.75 76,50.5 66.5,50.5 60.5,56.25 64.75,52.25 71.5,50.5 72,47.75 64,47.5 59.75,51.75 81,71 85.5,68.25 75.5,67 72.75,58.5 76.25,55 69,59 64.75,59 14.5,35.5 14.5,40.75 14.5,46.25 17.5,43.75 23.5,40.5 23.5,46 17.5,49.25 23.5,51.75 17.5,55.5 14.5,52 14.5,58.5 15.25,64 15,70.25 20.25,75 29.25,75 32.25,49.5 32.25,47.25 35.75,49.75 35.75,47.5 42.75,47.25 42.75,49.75 47.75,50.25 48.5,47.25 55.5,49.5 55.75,47.25 67.25,13.25 67.5,6.75 71.25,6.5 75.75,6.5 87.25,13 91.25,13.25 87.25,9.75 87,4.75 47,13.5 47.25,6.75 51.25,6.5 56,6.5 36,6.5 31,6.5 27.25,6.75 26.75,13.5 13.5,13.25 10,15 10,19.25 9.75,8 12.75,10.25 13,5 16,5 15.75,8.5 24.25,1.75 31,1.75 38.38,1.75 18.5,1.88 44,1.75 51.12,1.75 58.75,1.75 64.12,1.75 71.38,1.75 78.62,1.75
  pour Bottom (isolate 0.5): 0.31,79.62 99.44,79.62 99.44,0.44 0.31,0.44
  pour Top (isolate 0.5): 0.25,79.75 99.56,79.75 99.56,0.5 0.25,0.5
IRQ0  (1 unrouted)
  Bottom 0.406: PORT0.A02(IRQ) 27.44,36 R17.1 28.75,37.1 28.75,38.94 25.62,38.94 24.97,39.59 IRQ_LATCH.14
IRQ1  (via drill 0.5)
  Top 0.406: v34.12,40.62 43.94,40.62 v45.62,38.94
  Bottom 0.254: 47.62,35.88 47.5,35.88 | 47.5,36 47.5,36.12 | 47.5,36.25 47.62,36.25 47.38,36 | 47.5,36.25 47.62,36.12 47.5,36 | 47.5,36.25 47.5,36.12 | 47.5,36.12 47.62,36 | 47.62,35.88 47.62,35.75 47.5,35.88 | 47.5,35.88 47.5,36 | 47.5,36 47.62,35.88
  Bottom 0.406: PORT1.A02(IRQ) 47.38,36 47.5,36 47.62,36 | 47.62,36 47.62,35.88 R16.1 | 47.62,36 47.62,36.12 47.62,36.25 D2.C 47.61,38.94 v45.62,38.94 | IRQ_LATCH.13 26.24,41.57 27.19,40.62 v34.12,40.62
IRQ2  (via drill 0.5, 0.5 pad 0.5)
  Top 0.406: v36.12,44 v42.56,44 | v64.44,44 64.69,44 65.25,43.44 v65.25,39.44
  Bottom 0.406: IRQ_LATCH.12 27.51,63.32 27.44,63.25 27.44,45 28.44,44 v36.12,44 | PORT2.A02(IRQ) 67.74,36 R15.1 67.7,36.04 67.7,38.88 D4.C 65.76,38.92 v65.25,39.44 | v42.56,44 v64.44,44
IRQ3  (via drill 0.5)  (1 unrouted)
  Top 0.406: v36.12,45.69 v42.56,45.69
  Bottom 0.406: PORT3.A02(IRQ) 87.81,36 R14.1 | 87.69,35.94 87.88,35.94 87.88,36.06 87.75,36.06 87.75,38.92 D1.C 87.92,38.92 87.94,38.94 | IRQ_LATCH.11 28.78,46.59 29.69,45.69 v36.12,45.69 | 87.94,38.94 89.31,38.94 90.5,40.12 90.5,43 89.5,44 80.25,44 78.56,45.69 v42.56,45.69 | 87.94,38.94 87.88,39
MOSI
  Bottom 0.125: PORT3.A23(SLOWCLKMOSI) 81.62,12.12 79.74,12.12 arc58 78.99,11.78 78.76,11.4 arc-58 78.37,11.12 67.12,11.12 65.25,13 PORT2.A23(SLOWCLKMOSI) 61.62,12.12 59.63,12.12 arc58 59.05,11.86 58.79,11.45 arc-58 58.31,11.12 47.12,11.12 45.25,13 PORT1.A23(SLOWCLKMOSI) 41.62,12.12 39.6,12.12 arc58 39.07,11.89 38.78,11.44 arc-58 38.33,11.12 27,11.12 25.12,13 PORT0.A23(SLOWCLKMOSI)
N$1
  Bottom 0.254: 78.25,56 80,54.25 U$1.A13(INTACK_SER)
  Bottom 0.406: INTACK_LATCH.14 55.28,59.53 56,60.25 72.75,60.25 77,56 78.25,56
N$2
  Bottom 0.125: PORT1.A12(TDI) 42.33,24.06 arc14 42.17,24.05 41.6,23.92 arc-44 40.7,24.01 38.47,25.41 arc31 37.72,25.62 33.09,25.62 | PORT0.A13(TDO) 21.25,23.25 19.12,24.62 18.48,25.01 arc51 17.51,25.03 16.62,24.62 IC5.2
  Bottom 0.2: PORT0.A13(TDO) 25.62,23 27.5,24.62 31.62,24.62 32.38,25.62 33.09,25.62 IC6.1
N$3  (via drill 0.5)  (1 unrouted)
  Top 0.254: 65.88,49 78.5,49 79.5,50 80.75,50 81.75,51 U$1.A15(SH/LD_PRSNT/IRQ)
  Top 0.406: v22.5,67.25 31.88,67.25 v43.75,55.25 59.62,55.25 65.88,49
  Bottom 0.125: 22.43,67.44 v22.5,67.25 | 43.75,52.25 44,52 43.88,52
  Bottom 0.406: IRQ_LATCH.1 22.43,67.44 | v43.75,55.25 43.75,52.25
N$4
  Bottom 0.254: 53.25,63 78.75,63 79.25,62 81.5,62 U$1.A07(INTACK_SCK)
  Bottom 0.406: INTACK_LATCH.11 51.47,61.22 53.25,63
N$5
  Top 0.406: JTAG.2 SJ1.2
N$6
  Bottom 0.125: PORT2.A12(TDI) 62.25,24 61.97,23.87 arc-43 60.65,24.02 58.74,25.25 58.3,25.55 arc23 57.94,25.62 52.72,25.62 IC8.1 52.59,25.62 | PORT1.A13(TDO) 41.2,23.39 arc-14 40.94,23.52 39.25,24.56 38.4,24.99 arc37 37.6,24.99 36.5,24.62 IC6.2
  Bottom 0.2: PORT1.A13(TDO) 45.75,23 47.38,24.62 51.25,24.62 52.12,25.62 52.72,25.62
N$7
  Bottom 0.125: PORT3.A12(TDI) 82.12,24 81.83,23.93 arc-48 80.52,24.1 78.99,25.21 arc34 77.63,25.62 72.5,25.62 | 63.75,23 PORT2.A13(TDO) 61.06,23.44 58.81,24.75 58.38,25 arc36 57.62,25.01 56.38,24.62 IC8.2
  Bottom 0.2: IC7.1 72.5,25.62 71.62,24.62 67.38,24.62 65.75,23 PORT2.A13(TDO)
N$8  (1 unrouted)
  Bottom 0.125: IRQ_LATCH.4 | IRQ_LATCH.6 28.88,69.6 | 30.12,63.5 30,63.5
  Bottom 0.406: IRQ_LATCH.3 24.97,70.97 | 24.97,70.97 25.25,71.25 26,71.25 26.25,71 | 26.25,71 IRQ_LATCH.4 | IRQ_LATCH.5 27.51,70.99 | 27.51,70.99 27.25,71.25 26.5,71.25 26.25,71 | IRQ_LATCH.6 28.78,70.97 28.5,71.25 27.77,71.25 27.51,70.99 | R7.1 20.62,70.88 21,71.25 24.69,71.25 24.97,70.97 | 28.88,69.6 28.88,66.75 30.12,65.5 30.12,63.5
N$9
  Bottom 0.254: 54.25,61.5 76.75,61.5 77.25,61 78.75,61 79.25,60 81.5,60 U$1.A09(INTACK_RCK)
  Bottom 0.406: INTACK_LATCH.12 52.74,59.99 54.25,61.5
N$10
  Bottom 0.125: 41.16,59.75 41.28,59.62
  Bottom 0.406: PRSNT_LATCH.14 41.28,59.62 41.28,60.38 R12.1 | PRSNT_LATCH.13 40.01,59.51 | 40.01,59.51 40.25,59.75 41.16,59.75 | PRSNT_LATCH.12 38.74,59.49 | 38.74,59.49 39,59.75 39.77,59.75 40.01,59.51 | PRSNT_LATCH.11 37.47,59.47 | 37.47,59.47 37.75,59.75 38.48,59.75 38.74,59.49 | PRSNT_LATCH.10 36.2,59.45 36.5,59.75 37.19,59.75 37.47,59.47
N$11  (via drill 0.5, 0.5 pad 0.5)  (1 unrouted)
  Top 0.406: v42.56,42.38 v30.62,42.38 30.62,59.12 29.62,60.12 20.5,60.12 v20,60.62
  Bottom 0.254: U$1.A03(IRQ) 83.25,66 83.75,67 83.75,71.25
  Bottom 0.406: D1.A D4.A 47.69,42.33 D2.A 42.58,42.39 v42.56,42.38 | v30.62,42.38 28.7,42.38 D3.A | v20,60.62 20,62.44 19.94,62.44 19.88,62.5 18.19,62.5 16.88,63.81 16.88,69.44 20.44,73 82,73 83.75,71.25
N$13
  Bottom 0.254: U$1.A05(PRSNT_DATAIN) 81.5,64 79.25,64 78.75,65 39.12,65
  Bottom 0.406: PRSNT_LATCH.9 34.93,60.8 39.12,65
N$17
  Bottom 0.406: IRQ_LATCH.9 32.05,63.55 37.25,68.75 80.75,68.75 U$1.A01(IRQ_DATAIN)
PPS
  Bottom 0.125: PORT3.A26(PPS) 82,10 81.25,9.25 81.25,8.75 80.62,8.12 79.25,8.12 78.75,8.88 77.25,8.88 76.62,8 67.38,8 65.25,10 PORT2.A26(PPS) 62,10 61.25,9.25 61.25,8.88 60.5,8.12 59.25,8.12 58.75,8.88 57.12,8.88 56.62,8 47.25,8 45.25,10 PORT1.A26(PPS) 42,10 41.25,9.25 41.25,8.75 40.62,8.12 39.25,8.12 38.75,8.88 37.25,8.88 36.62,8 27.38,8 25.25,10 PORT0.A26(PPS)
PRSNT0
  Bottom 0.125: R1.2 15.72,33.6 17.12,35 18.5,35 19.5,36 21.5,36 PORT0.A01(PRSNT1)
  Bottom 0.2: 30.75,35 23.75,35 23.12,36.25
  Bottom 0.305: 23.12,36.25 22.88,36.62 PORT0.A01(PRSNT1)
  Bottom 0.406: IC5.4 11.15,23.62 10,23.62 9.25,24.38 9.25,31.88 10.97,33.6 R1.2 | PRSNT_LATCH.6 37.47,41.59 30.75,35
PRSNT1  (via drill 0.5)
  Top 0.406: v29,23.75 28.5,24.38 28.5,25 30.62,27 v30.62,33.25
  Bottom 0.406: IC6.4 29.43,23.68 v29,23.75 | v30.62,33.25 31.23,33.85 R2.2 33.73,34.1 38.38,38.75 38.5,38.88 | PRSNT_LATCH.5 38.74,39.12 38.5,38.88 | PORT1.A01(PRSNT1) 42.5,37.25 40.88,38.88 38.5,38.88
PRSNT2  (via drill 0.5)  (1 unrouted)
  Top 0.406: v49,23.75 48.62,24.25 48.62,25.12 50.62,26.88 50.62,33.38 50.65,33.38 v51.13,33.85 51.1,33.85
  Bottom 0.406: IC8.4 50,23.75 v49,23.75 | v51.13,33.85 R3.2 | PRSNT_LATCH.4 40.01,41.18 40.94,40.25 51.25,40.25 52.5,39 R3.2 | 62.5,36.88 62.12,37.44 61.25,38.44 58.25,38.44 53.91,34.1 R3.2
PRSNT3  (via drill 0.5)
  Top 0.406: v69.25,23.75 68.88,24.25 68.88,25 71.12,27.25 v71.12,33.38
  Bottom 0.254: 73.44,34.12 73.4,34.12 R4.2
  Bottom 0.406: IC7.4 70.25,23.75 v69.25,23.75 | PRSNT_LATCH.3 41.28,41.59 41.81,41.06 72.06,41.06 73.38,39.75 R4.2 | 73.38,34.19 73.44,34.12 | PORT3.A01(PRSNT1) 80.94,38.56 78.31,38.56 73.85,34.1 R4.2 | v71.12,33.38 71.85,34.1 R4.2
RX+
  Bottom 0.125: R10.2 88.65,15.79 arc49 88.2,16 PORT3.A20(BUS1+) 84.38,16.12 79.54,16.12 arc58 79.1,15.88 78.76,15.34 arc-58 78.38,15.12 65.63,15.12 arc-45 65.19,15.31 PORT2.A20(BUS1+) 64.38,16.12 59.6,16.12 arc58 59.07,15.83 58.77,15.36 arc-58 58.35,15.12 45.58,15.12 arc-45 45.23,15.27 PORT1.A20(BUS1+) 44.38,16.12 39.53,16.12 arc58 39.1,15.89 38.76,15.34 arc-58 38.38,15.12 25.53,15.12 arc-45 25.27,15.23 PORT0.A20(BUS1+) 22.18,16 arc-45 22.09,16.04 22.04,16.09 arc45 21.95,16.12 19.53,16.12 arc58 19.04,15.89 18.78,15.43 arc-58 18.34,15.12 14.47,15.12 13.72,15.88 R8.2
RX-
  Bottom 0.125: R10.1 PORT3.A21(BUS1-) 81.81,15.69 arc45 81.36,15.88 79.59,15.88 arc58 79.32,15.69 79,15.18 arc-58 78.4,14.88 65.32,14.88 arc-45 65.2,14.93 arc45 65.02,15 PORT2.A21(BUS1-) 61.77,15.73 arc45 61.42,15.88 59.58,15.88 arc58 59.33,15.7 59,15.18 arc-58 58.4,14.88 45.41,14.88 arc-45 45.14,14.98 arc45 45.1,15 PORT1.A21(BUS1-) 41.77,15.73 arc45 41.42,15.88 39.58,15.88 arc58 39.33,15.7 39,15.18 arc-58 38.4,14.88 25.43,14.88 arc-45 25.12,15 PORT0.A21(BUS1-) 21.77,15.73 arc45 21.42,15.88 19.58,15.88 arc58 19.33,15.7 19.04,15.23 arc-58 18.33,14.88 13,14.88 12.03,15.85 R8.1
SHIFT  (via drill 0.5)
  Top 0.254: 78.75,46.5 80.38,47.5 U$1.A17(IRQ/PRSNT_CLK)
  Top 0.406: v25,66 30.5,66 v42.5,54.12 59.38,54.12 67,46.5 78.75,46.5
  Bottom 0.125: 42.5,52.1 PRSNT_LATCH.2
  Bottom 0.406: IRQ_LATCH.2 23.7,68.3 v25,66 | v42.5,54.12 42.5,52.1
TCK
  Bottom 0.125: 85.5,21 PORT3.A15(TCK) 81.62,21.88 79.25,21.88 78.75,21.12 65.38,21.12 65.25,21 PORT2.A15(TCK) 61.62,21.88 59.25,21.88 58.75,21.12 45.38,21.12 45.25,21 PORT1.A15(TCK) 41.62,21.88 39.25,21.88 38.75,21.12 25.38,21.12 25.25,21 PORT0.A15(TCK)
  Bottom 0.2: JTAG.7 86.46,21.96 85.5,21
TDI
  Top 0.2: 24.88,24 29.88,19 38.5,19 39.5,20 43,20 44,19 58.5,19 59.5,20 63,20 64,19 78.5,19 79.5,20 83,20 84,21 87.12,21 89,22.88 89,26.35 JTAG.1
  Top 0.305: PORT0.A12(TDI) 24.88,24
  Bottom 0.125: PORT0.A12(TDI) 22.25,24 22.25,24 arc-56 20.7,23.95 18.71,25.33 arc33 17.71,25.62 13.84,25.62 IC5.1
TDO
  Bottom 0.125: 85.5,23 PORT3.A13(TDO) 81,23.44 79.12,24.62 78.44,24.98 arc37 77.56,24.98 76.5,24.62 IC7.2
  Bottom 0.2: JTAG.3 89.54,27.04 85.5,23
TMS
  Bottom 0.125: 85.5,22 PORT3.A14(TMS) 84.38,22.12 79.25,22.12 78.75,23 77.25,23 76.62,22 PORT2.A14(TMS) 64.38,22.12 59.25,22.12 58.62,23 57.25,23 56.62,22 PORT1.A14(TMS) 44.38,22.12 39.25,22.12 38.75,23 37.25,23 36.5,22 PORT0.A14(TMS)
  Bottom 0.2: JTAG.5 88,24.5 85.5,22
TRST
  Bottom 0.125: PORT3.A16(TRST) 84.38,20.12 79.25,20.12 78.75,20.88 77.25,20.88 76.62,20 PORT2.A16(TRST) 64.38,20.12 59.25,20.12 58.75,20.88 57.25,20.88 56.75,20 PORT1.A16(TRST) 44.38,20.12 39.25,20.12 38.75,20.88 37.25,20.88 36.5,20 PORT0.A16(TRST)
  Bottom 0.2: JTAG.9 91.2,19.42 90.62,20 PORT3.A16(TRST)
TX+
  Bottom 0.125: R9.2 88.78,18.24 arc-53 88.3,18 PORT3.A18(BUS0+) 84.38,18.12 79.59,18.12 arc-56 79.06,18.41 78.9,18.65 arc56 78.48,18.88 65.84,18.88 arc41 65.24,18.65 PORT2.A18(BUS0+) 64.38,18.12 59.55,18.12 arc-56 59.08,18.37 58.9,18.64 arc56 58.47,18.88 45.73,18.88 arc41 45.32,18.72 PORT1.A18(BUS0+) 44.38,18.12 39.52,18.12 arc-56 39.1,18.35 38.9,18.64 arc56 38.47,18.88 25.64,18.88 arc45 25.19,18.69 PORT0.A18(BUS0+) 22.2,18 arc45 22.07,17.95 arc-45 21.9,17.88 19.6,17.88 arc-58 19.07,18.17 18.77,18.64 arc58 18.35,18.88 14.47,18.88 R6.2
TX-
  Bottom 0.125: R9.1 87.62,19 87.62,18.88 87.75,19 R9.1 | R9.1 PORT3.A17(BUS0-) 81.77,19.73 arc45 81.42,19.88 79.45,19.88 arc56 79.14,19.71 78.9,19.36 arc-56 78.47,19.12 65.43,19.12 arc45 65.34,19.09 65.32,19.07 arc-45 65.15,19 PORT2.A17(BUS0-) 61.81,19.69 arc45 61.37,19.88 59.45,19.88 arc56 59.14,19.71 58.88,19.33 arc-56 58.51,19.12 45.43,19.12 arc45 45.34,19.09 45.3,19.05 arc-45 45.18,19 PORT1.A17(BUS0-) 41.81,19.69 arc45 41.36,19.88 39.52,19.88 arc56 39.1,19.65 38.92,19.37 arc-56 38.45,19.12 25.3,19.12 arc45 25.21,19.09 25.2,19.07 arc-45 25.02,19 PORT0.A17(BUS0-) 21.82,18.32 arc-45 21.35,18.12 19.65,18.12 arc-58 19.29,18.36 19,18.83 arc58 18.4,19.12 13.03,19.12 R6.1
(copper drawn outside any net)
  shapes: Bottom area x2

### Text on the board
Top: busmaster | hgg friendship0 | (CC-BY-NC-SA 3.0) 2012 | hadez@hgg.aero | armin@hgg.aero | JTAG | port3 | port2 | port1 | port0
Bottom: IRQ | PRSNT | INTACK | port0